# Altium project FunKello.PrjPcb
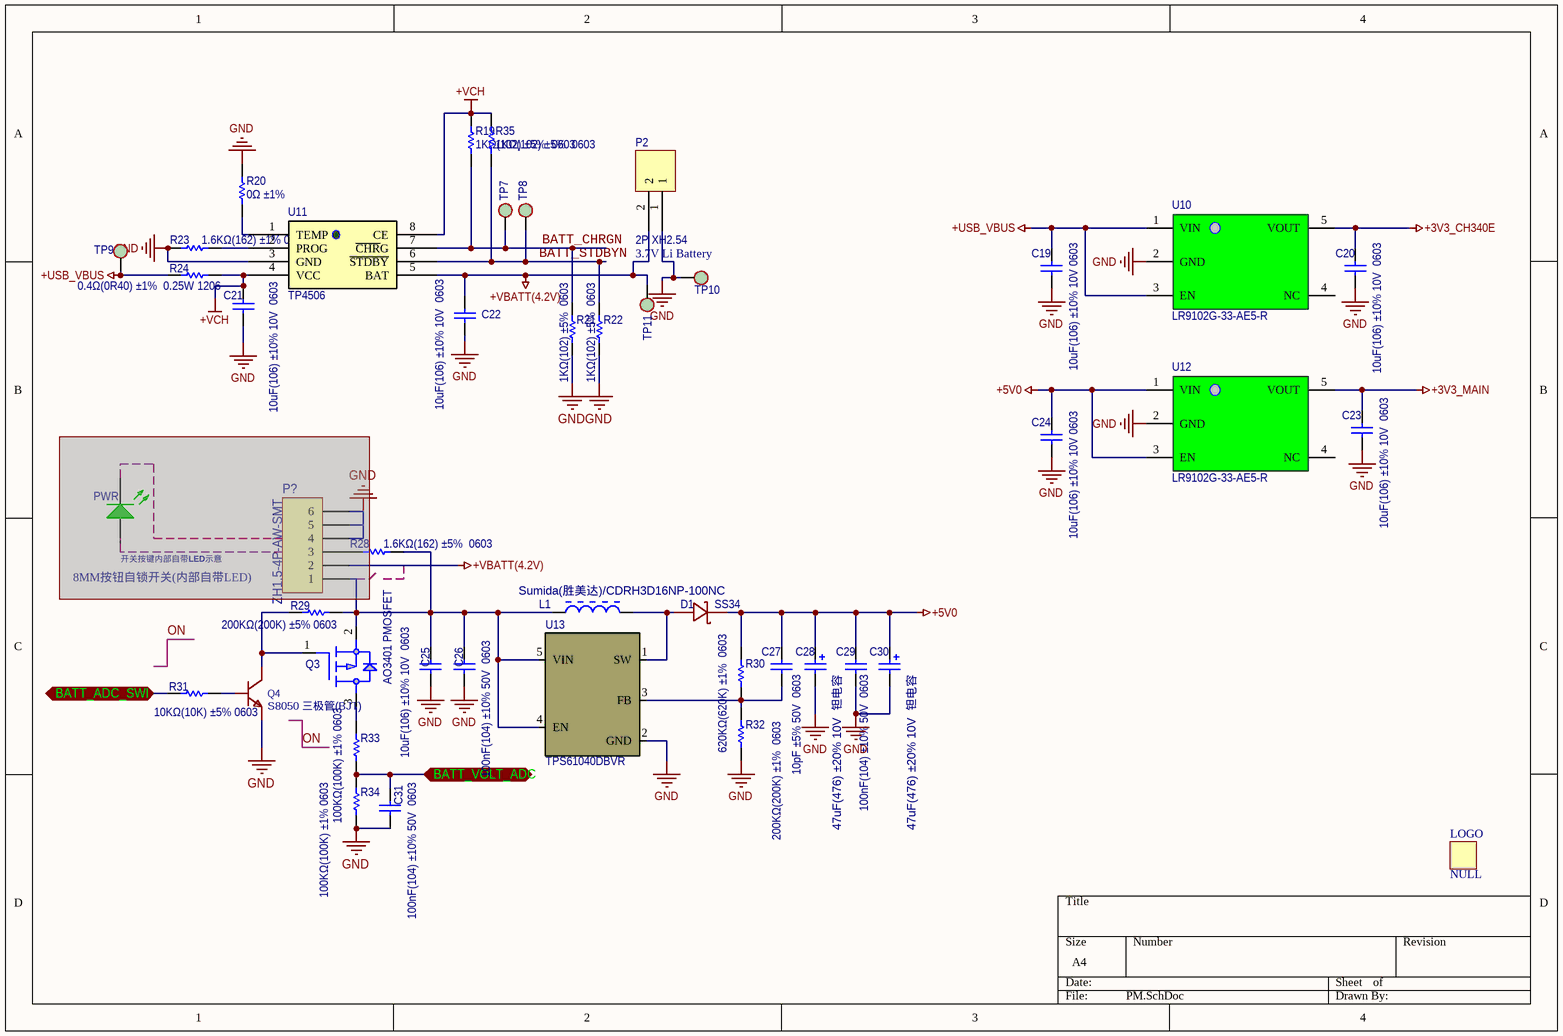
[diagram p0: PM.SchDoc]
8 sheets, 111 parts. Net scope: flat (ports and power ports of the same name join across sheets).
Board file: FunKello.PcbDoc
Sheets:
  PM.SchDoc
  USB.SchDoc
  SD.SchDoc
  MCU.SchDoc
  BEEP.SchDoc
  KEY.SchDoc
  LED.SchDoc
  SENSOR.SchDoc

## Sheet PM.SchDoc
size A4

### Parts
C19  10uF(106) ±10% 10V 0603  [C0603]
C20  10uF(106) ±10% 10V  0603  [C0603]
C21  10uF(106) ±10% 10V  0603  [C0603]
C22  10uF(106) ±10% 10V  0603  [C0603]
C23  10uF(106) ±10% 10V  0603  [C0603]
C24  10uF(106) ±10% 10V 0603  [C0603]
C25  10uF(106) ±10% 10V  0603  [C0603]
C26  100nF(104) ±10% 50V  0603  [C0603]
C27  10pF ±5% 50V  0603  [C0603]
C28  47uF(476) ±20% 10V  钽电容  [CASE-B_3528]
C29  100nF(104) ±10% 50V  0603  [C0603]
C30  47uF(476) ±20% 10V  钽电容  [CASE-B_3528]
C31  100nF(104) ±10% 50V  0603  [C0603]
D1  SS34  [SMA]
L1  Sumida(胜美达)/CDRH3D16NP-100NC  [L_3.8x3.8x1.8mm]
LED?  注释: PWR  [Through Hole-LED1]  (hidden comment: 翠绿LED, 贴片  发光二极管  0805)  (masked out: inside a compile mask, not in the netlist)
LOGO  NULL  [MYLOGO_BOTTOM]
P2  2P XH2.54  注释: 3.7V Li Battery  [MX1.25-2P]
P?  ZH1.5-4P-AW-SMT  注释: 8MM按钮自锁开关(内部自带LED)  [ZH1.5-6(4P)卧式-SMT]  (masked out: inside a compile mask, not in the netlist)
Q3  AO3401 PMOSFET  [SOT233]
Q4  S8050 三极管(BJT)  [SOT233]
R19  1KΩ(102) ±5%  0603  [R0603]
R20  0Ω ±1%  [R0603]
R21  1KΩ(102) ±5%  0603  [R0603]
R22  1KΩ(102) ±5%  0603  [R0603]
R23  1.6KΩ(162) ±1% 0603  [R0603]
R24  0.4Ω(0R40) ±1%  0.25W 1206  [R1206]
R28  1.6KΩ(162) ±5%  0603  [R0603]
R29  200KΩ(200K) ±5% 0603  [R0603]
R30  620KΩ(620K) ±1%  0603  [R0603]
R31  10KΩ(10K) ±5% 0603  [R0603]
R32  200KΩ(200K) ±1%  0603  [R0603]
R33  100KΩ(100K) ±1% 0603  [R0603]
R34  100KΩ(100K) ±1% 0603  [R0603]
R35  1KΩ(102) ±5%  0603  [R0603]
TP7  NC  [TP]  (value not drawn)
TP8  NC  [TP]  (value not drawn)
TP9  NC  [TP]  (value not drawn)
TP10  NC  [TP]  (value not drawn)
TP11  NC  [TP]  (value not drawn)
U10  LR9102G-33-AE5-R  [SOT-235]
U11  TP4506  [ESOP-8]
U12  LR9102G-33-AE5-R  [SOT-235]
U13  TPS61040DBVR  [SOT-235]

### Ports
BATT_ADC_SWI, BATT_VOLT_ADC

### Nets
+3V3_CH340E: C20.2 U10.5(VOUT)
+3V3_MAIN: C23.2 U12.5(VOUT)
+5V0: C24.2 C27.1 C28.1 C29.1 C30.1 D1.1(C) R30.1 U12.1(VIN) U12.3(EN)
+USB_VBUS: C19.2 R24.2 TP9.1 U10.1(VIN) U10.3(EN)
+VBATT(4.2V): C22.2 P2.2 TP11.1 U11.5(BAT)
+VCH: C21.2 R19.1 R24.1 R35.1 U11.4(VCC) U11.8(CE)
GND: C19.1 C20.1 C21.1 C22.1 C23.1 C24.1 C25.2 C26.2 C28.2 C29.2 C30.2 C31.1 P2.1 Q4.2(E) R20.1 R21.2 R22.2 R23.2 R32.2 R34.2 TP10.1 U10.2(GND) U11.3(GND) U12.2(GND) U13.2(GND)
BATT_CHRGN: R19.2 R21.1 TP7.1 U11.7(~{CHR}G)
BATT_STDBYN: R22.1 R35.2 TP8.1 U11.6(~{STDBY})
NetC25_1: C25.1 C26.1 L1.1 Q3.2(SOURCE) R28.1 R29.1 U13.4(EN) U13.5(VIN)
NetC27_2: C27.2 R30.2 R32.1 U13.3(FB)
NetC31_2: C31.2 R33.2 R34.1 ; port BATT_VOLT_ADC
NetD1_2: D1.2(A) L1.2 U13.1(SW)
NetQ3_1: Q3.1(GATE) Q4.3(C) R29.2
NetQ3_3: Q3.3(DRAIN) R33.1
NetQ4_1: Q4.1(B) R31.1
NetR20_2: R20.2 U11.1(TEMP)
NetR23_1: R23.1 U11.2(PROG)
NetR31_2: R31.2 ; port BATT_ADC_SWI

Not connected (* = marked no-connect by the designer): R28 2; U10 4(NC); U12 4(NC)

### Notes on the sheet
- (near LED?) 开关按键内部自带LED示意
- ON

### Library data of the parts
C19-C27 C29 C31 = Cap: 0603贴片电容; Published: 8-Jun-2000; LatestRevisionDate: 17-Jul-2002; LatestRevisionNote: Re-released for DXP Platform.; PackageReference: RAD-0.3; Publisher: Altium Limited; PackageDescription: Radial Cap, Thru-Hole; 2 Leads; 0.3 in Pin Spacing
C28 C30 = Cap Pol2: CASE_B 3528钽电容; Published: 8-Jun-2000; LatestRevisionDate: 17-Jul-2002; LatestRevisionNote: Re-released for DXP Platform.; PackageReference: POLAR0.8; Publisher: Altium Limited; PackageDescription: Polarized Capacitor; 2 Leads
D1 = PMEG3005EB,115: Shottky 二极管; BOM_Manufacturer: Nexperia; Contributor: LCSC; BOM_Supplier: LCSC; BOM_Supplier Part: C455040; BOM_Manufacturer Part: PMEG3005EB,115; spicePre: D; spiceSymbolName: PMEG3005EB,115
L1 = CMP-0686-00187-3: Chip Ferrite Bead for General Use, 600 Ohm, 300 mA, -55 to 125 degC, 1 x 0.5 x 0.55 mm SMD, Tape and Reel; Manufacturer: Murata; PartNumber: BLM15AG601SN1D; Impedance (at 100 MHz): 600 Ohm +/- 25%; DC Resistance: 0.52 Ohm Max.; Rated Current: 300 mA; PackageDescription: 2-Pin Chip, Body 1 x 0.5 mm; Mounting Technology: Surface Mount; ComponentLink1Description: Manufacturer URL; ComponentLink3Description: Package Specification; ComponentLink2Description: Datasheet; Operating Temperature Range: -55 to 125 degC; Packing: Tape and Reel; ComponentLink1URL: http://www.murata.com/; PackageReference: BLM15-2; DatasheetVersion: 08/2013; ComponentLink3URL: http://www.murata.com/products/catalog/pdf/c31e.pdf; ComponentLink2URL: http://www.murata.com/products/catalog/pdf/c31e.pdf; Value: Sumida(胜美达)/CDRH3D16NP-100NC
LED? = LTST-C190KGKT: LED GREEN CLEAR 0603 SMD; Manufacturer: Lite-On Inc.; Manufacturer part #: LTST-C190KGKT; Creation date: 04-Jul-2017; Created by: eteofilo; Modified by: *; Indications: *; Value: *
LOGO = MYLOGO_BOTTOM: LOGO
P2 = Header 2x1 0.05'' PTH: XH2.54-2P座子; Manufacturer: Sullins Connector Solutions; Manufacturer Part #: GRPB021VWVN-RC; Created By: Jose; Creation Date: 7-Sept-2017; Modified by: *; Indications: *
P? = Header 6: Header, 6-Pin; LatestRevisionDate: 17-Jul-2002; LatestRevisionNote: Re-released for DXP Platform.; Publisher: Altium Limited
Q3 = MOSFET_P_0: P沟道 MOSFET
Q4 = S8050_C908252: NPN 三极管(BJT); BOM_Manufacturer: FUXINSEMI; Contributor: LCSC; BOM_Supplier: LCSC; BOM_Supplier Part: C908252; BOM_Manufacturer Part: S8050; BOM_JLCPCB Part Class: Extended Part; spicePre: Q; spiceSymbolName: S8050_C908252
R19-R23 R28-R35 = Res1: 0603贴片电阻; Published: 8-Jun-2000; LatestRevisionDate: 17-Jul-2002; LatestRevisionNote: Re-released for DXP Platform.; PackageReference: AXIAL-0.3; Publisher: Altium Limited; PackageDescription: Axial Device, Thru-Hole; 2 Leads; 0.3 in Pin Spacing
R24 = Res1: 1206贴片电阻; Published: 8-Jun-2000; LatestRevisionDate: 17-Jul-2002; LatestRevisionNote: Re-released for DXP Platform.; PackageReference: AXIAL-0.3; Publisher: Altium Limited; PackageDescription: Axial Device, Thru-Hole; 2 Leads; 0.3 in Pin Spacing
TP7-TP11 = TP: 测试点
U10 U12 = LR9102G-33-AE5-R: 线性稳压器(LDO)
U11 = TP4056: 锂电池充电管理IC
U13 = TPS61040 /Boost: DCDC电源IC

## Sheet USB.SchDoc
size A4
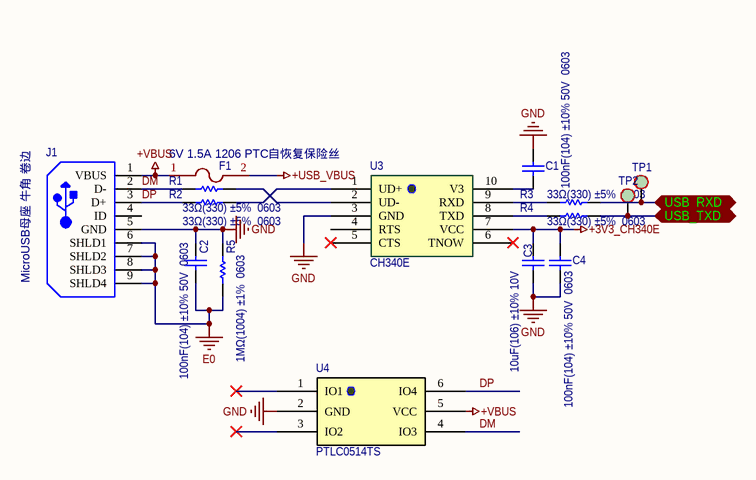
[diagram p1: USB.SchDoc]

### Parts
C1  100nF(104) ±10% 50V  0603  [C0603]
C2  100nF(104) ±10% 50V  0603  [C0603]
C3  10uF(106) ±10% 10V  [C0603]
C4  100nF(104) ±10% 50V  0603  [C0603]
F1  6V 1.5A 1206 PTC自恢复保险丝  [F1206]
J1  MicroUSB母座 牛角 卷边  [MICRO USB 母座 小牛角有柱 卷边]
R1  33Ω(330) ±5%  0603  [R0603]
R2  33Ω(330) ±5%  0603  [R0603]
R3  33Ω(330) ±5%  0603  [R0603]
R4  33Ω(330) ±5%  0603  [R0603]
R5  1MΩ(1004) ±1%  0603  [R0603]
TP1  NC  [TP]  (value not drawn)
TP2  NC  [TP]  (value not drawn)
U3  CH340E  [MSOP-10]
U4  PTLC0514TS  [SOT-236]

### Ports
USB_RXD, USB_TXD

### Nets
+3V3_CH340E: C3.2 C4.1 U3.7(VCC)
+USB_VBUS: F1.2
+VBUS: F1.1 J1.1(VBUS) U4.5(VCC)
E0: C2.1 J1.6(SHLD1) J1.7(SHLD2) J1.8(SHLD3) J1.9(SHLD4) R5.1
GND: C1.1 C2.2 C3.1 C4.2 J1.5(GND) R5.2 U3.3(GND) U4.2(GND)
DM: J1.2(D-) R1.2 U4.4(IO3)
DP: J1.3(D+) R2.2 U4.6(IO4)
NetC1_2: C1.2 U3.10(V3)
NetR1_1: R1.1 U3.2(UD-)
NetR2_1: R2.1 U3.1(UD+)
NetR3_1: R3.1 TP1.1 ; port USB_RXD
NetR3_2: R3.2 U3.9(RXD)
NetR4_1: R4.1 TP2.1 ; port USB_TXD
NetR4_2: R4.2 U3.8(TXD)

Not connected (* = marked no-connect by the designer): J1 4(ID); U3 4(RTS) 5(CTS)* 6(TNOW)*; U4 1(IO1)* 3(IO2)*

### Library data of the parts
C1-C4 = Cap: 0603贴片电容; Published: 8-Jun-2000; LatestRevisionDate: 17-Jul-2002; LatestRevisionNote: Re-released for DXP Platform.; PackageReference: RAD-0.3; Publisher: Altium Limited; PackageDescription: Radial Cap, Thru-Hole; 2 Leads; 0.3 in Pin Spacing
F1 = ASMD1206-150: 1206 PTC自恢复保险丝; BOM_Manufacturer: JDTFUSE; Contributor: LCSC; BOM_Paste Type: expand; BOM_Assembly Type: smtWeld; BOM_Supplier: LCSC; BOM_Manufacturer Part: ASMD1206-150; BOM_Supplier Part: C135341; spicePre: F; spiceSymbolName: ASMD1206-150
J1 = CMP-0029-00002-1: MicroUSB母座; Capacitance: 1 uF; Tolerance: 10%; ESR: 7.5 Ohm; Voltage Rating: 35 V; PackageDescription: USB Connector, 5 Position Surface Mount, Length 8 mm, Height 2.65 mm; DatasheetVersion: Aug-16; REACH SVHC: No SVHC; Package Quantity: 2000; ComponentLink1Description: Manufacturer URL; ComponentLink2URL: https://www.hirose.com/product/en/download_file/key_name/ZX62D-B-5P8/category/Catalog/doc_file_id/31704/?file_category_id=5&item_id=02420034000&is_series=; Length: 3.2 mm; ComponentLink1URL: https://www.hirose.com; Radiation Hardening: No; Height: 1.8 mm; Max Operating Temperature: 125degC; Weight: 0.000571 oz; Min Operating Temperature: -55degC; ComponentLink3Description: Package Specification; Width: 1.6 mm; Case Code (Metric): 3216; Mount: Surface Mount; ComponentLink2Description: Datasheet; Case Code (Imperial): 1206; ComponentLink3URL: https://www.hirose.com/product/en/download_file/key_name/ZX62D-B-5P8/category/Drawing%20(2D)/doc_file_id/36535/?file_category_id=6&item_id=02420034000&is_series=; Pins: 2; Resistance: 7.5 Ohm; Packaging: Tape and Reel; RoHSCompliant: True; Voltage Rating (DC): 35 V; Case/Package: 1206; PackageReference: ZX62D-B-5P8
R1-R5 = Res1: 0603贴片电阻; Published: 8-Jun-2000; LatestRevisionDate: 17-Jul-2002; LatestRevisionNote: Re-released for DXP Platform.; PackageReference: AXIAL-0.3; Publisher: Altium Limited; PackageDescription: Axial Device, Thru-Hole; 2 Leads; 0.3 in Pin Spacing
TP1 TP2 = TP: 测试点
U3 = CH340E: USB转串口IC

## Sheet SD.SchDoc
size A4
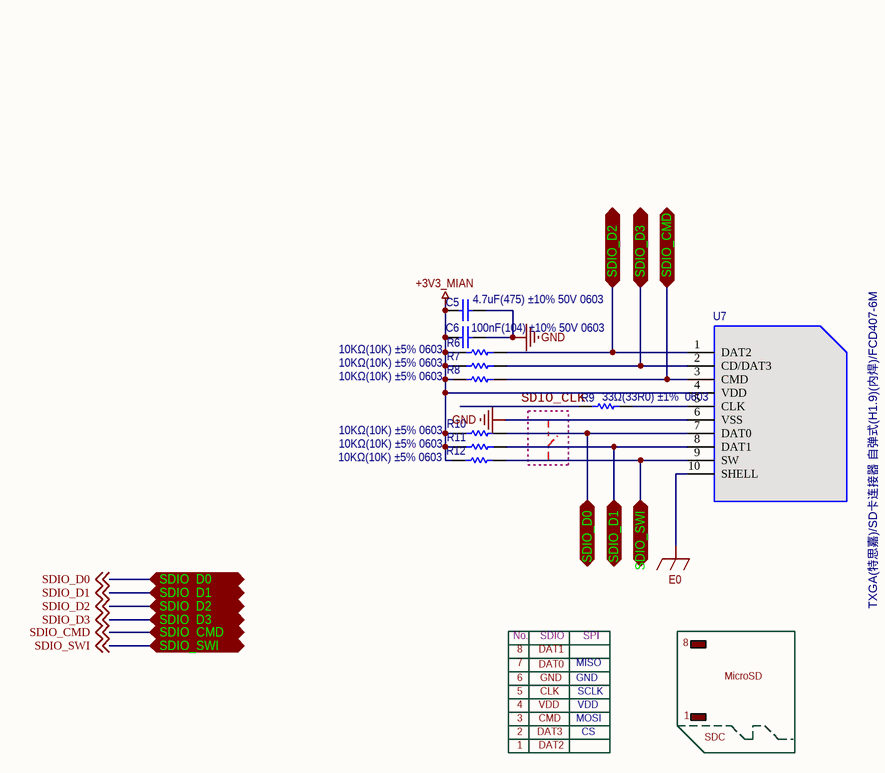
[diagram p2: SD.SchDoc]

### Parts
C5  4.7uF(475) ±10% 50V 0603  [C0603]
C6  100nF(104) ±10% 50V 0603  [C0603]
R6  10KΩ(10K) ±5% 0603  [R0603]
R7  10KΩ(10K) ±5% 0603  [R0603]
R8  10KΩ(10K) ±5% 0603  [R0603]
R9  33Ω(33R0) ±1%  0603  [R0603]
R10  10KΩ(10K) ±5% 0603  [R0603]
R11  10KΩ(10K) ±5% 0603  [R0603]
R12  10KΩ(10K) ±5% 0603  [R0603]
U7  TXGA(特思嘉)/SD卡连接器 自弹式(H1.9)(内焊)/FCD407-6M  [Micro SD]

### Ports
SDIO_CMD, SDIO_D0, SDIO_D1, SDIO_D2, SDIO_D3, SDIO_SWI

### Nets
+3V3_MIAN: C5.1 C6.2 R6.2 R7.2 R8.2 R10.2 R11.2 R12.2 U7.4(VDD)
E0: U7.10(SHELL)
GND: C5.2 C6.1 U7.6(VSS)
SDIO_CLK: R9.2
SDIO_CMD: R8.1 U7.3(CMD) ; off-sheet SDIO_CMD, port SDIO_CMD
SDIO_D0: R10.1 U7.7(DAT0) ; off-sheet SDIO_D0, port SDIO_D0
SDIO_D1: R11.1 U7.8(DAT1) ; off-sheet SDIO_D1, port SDIO_D1
SDIO_D2: R6.1 U7.1(DAT2) ; off-sheet SDIO_D2, port SDIO_D2
SDIO_D3: R7.1 U7.2(CD/DAT3) ; off-sheet SDIO_D3, port SDIO_D3
SDIO_SWI: R12.1 U7.9(SW) ; off-sheet SDIO_SWI, port SDIO_SWI
NetR9_1: R9.1 U7.5(CLK)

### Notes on the sheet
- No.
- 8
- 7
- DAT1
- DAT0
- SDIO
- MISO
- SPI
- 6
- 5
- 4
- 3
- 2
- DAT3
- VDD
- CMD
- GND
- CLK
- MOSI
- SCLK
- CS
- 1
- MicroSD
- DAT2
- SDC

### Library data of the parts
C5 C6 = Cap: Capacitor; Published: 8-Jun-2000; LatestRevisionDate: 17-Jul-2002; LatestRevisionNote: Re-released for DXP Platform.; PackageReference: RAD-0.3; Publisher: Altium Limited; PackageDescription: Radial Cap, Thru-Hole; 2 Leads; 0.3 in Pin Spacing
R6-R12 = Res1: Resistor; Published: 8-Jun-2000; LatestRevisionDate: 17-Jul-2002; LatestRevisionNote: Re-released for DXP Platform.; PackageReference: AXIAL-0.3; Publisher: Altium Limited; PackageDescription: Axial Device, Thru-Hole; 2 Leads; 0.3 in Pin Spacing
U7 = SD CARD/FCD407-6M

## Sheet MCU.SchDoc
size A4
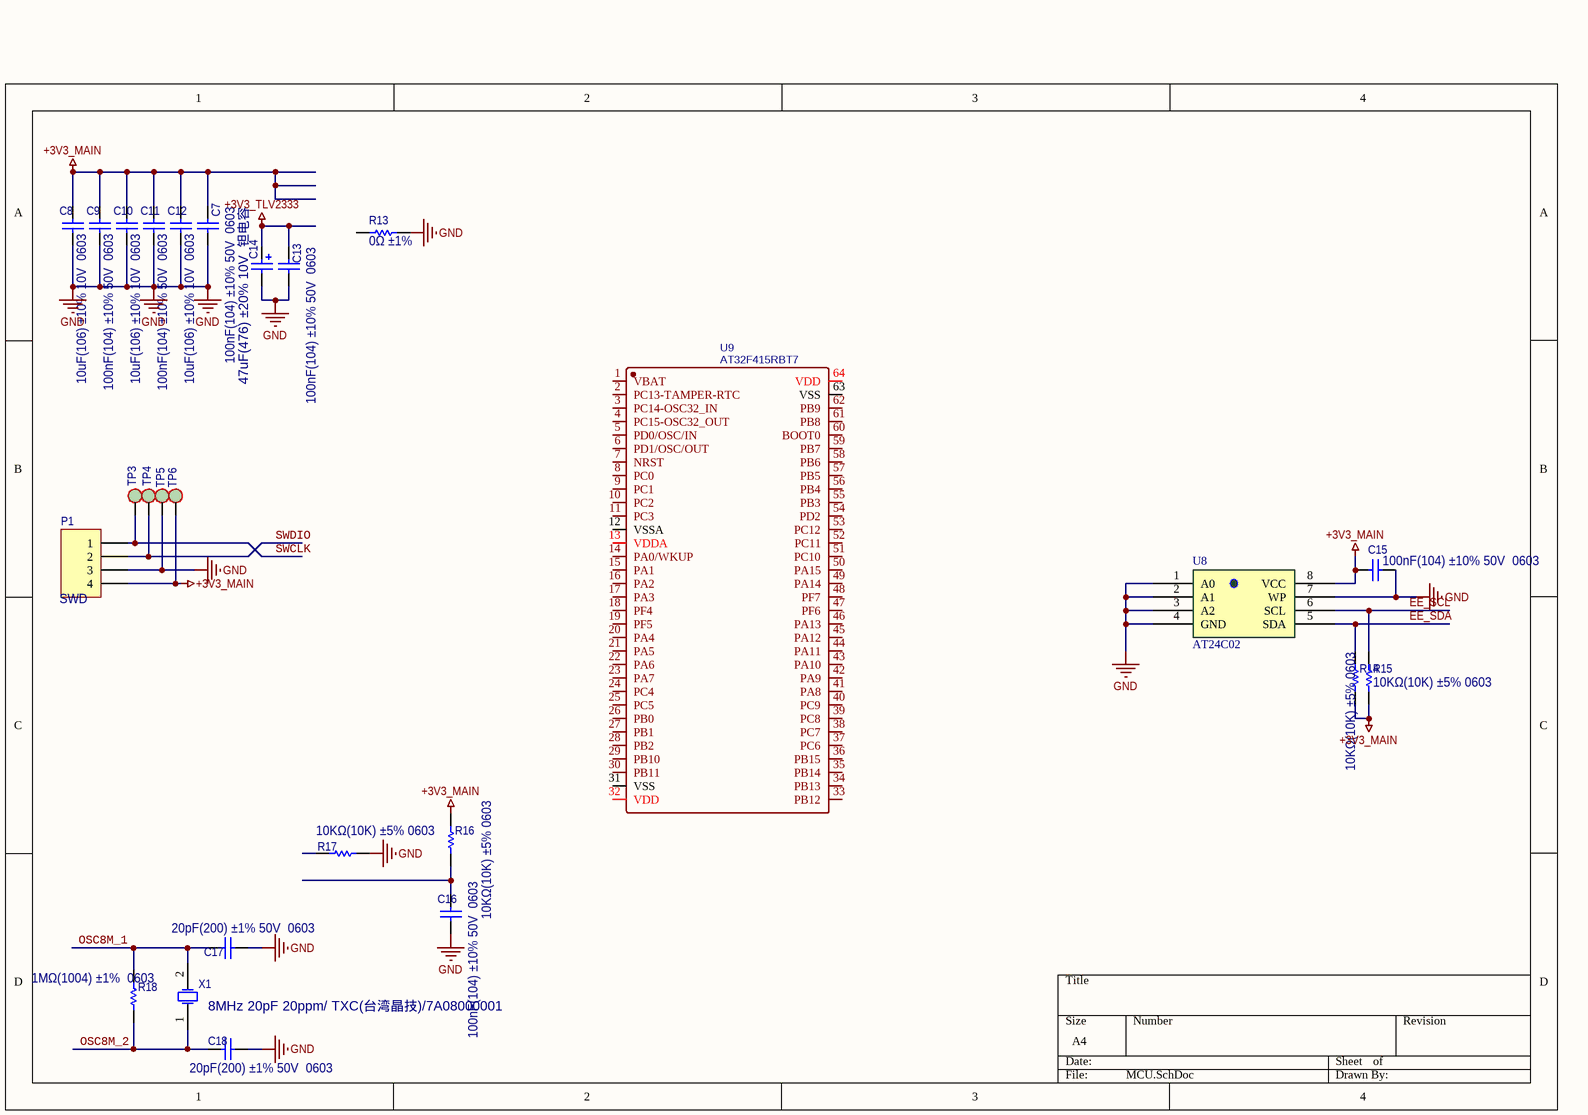
[diagram p3: MCU.SchDoc]

### Parts
C7  100nF(104) ±10% 50V  0603  [C0603]
C8  10uF(106) ±10% 10V  0603  [C0603]
C9  100nF(104) ±10% 50V  0603  [C0603]
C10  10uF(106) ±10% 10V  0603  [C0603]
C11  100nF(104) ±10% 50V  0603  [C0603]
C12  10uF(106) ±10% 10V  0603  [C0603]
C13  100nF(104) ±10% 50V  0603  [C0603]
C14  47uF(476) ±20% 10V  钽电容  [CASE-B_3528]
C15  100nF(104) ±10% 50V  0603  [C0603]
C16  100nF(104) ±10% 50V  0603  [C0603]
C17  20pF(200) ±1% 50V  0603  [C0603]
C18  20pF(200) ±1% 50V  0603  [C0603]
P1  SWD  [HDR1X4]
R13  0Ω ±1%  [R0603]
R14  10KΩ(10K) ±5% 0603  [R0603]
R15  10KΩ(10K) ±5% 0603  [R0603]
R16  10KΩ(10K) ±5% 0603  [R0603]
R17  10KΩ(10K) ±5% 0603  [R0603]
R18  1MΩ(1004) ±1%  0603  [R0603]
TP3  NC  [TP]  (value not drawn)
TP4  NC  [TP]  (value not drawn)
TP5  NC  [TP]  (value not drawn)
TP6  NC  [TP]  (value not drawn)
U8  AT24C02  [SOIC-8_150mil]
U9  AT32F415RBT7  [LQFP64]
X1  8MHz 20pF 20ppm/ TXC(台湾晶技)/7A08000001  [CRY5032_2P_SMT]

### Nets
+3V3_MAIN: C7.2 C8.2 C9.2 C10.2 C11.2 C12.2 C15.2 P1.4 R14.2 R15.2 R16.1 TP6.1 U8.8(VCC)
+3V3_TLV2333: C13.2 C14.1
GND: C7.1 C8.1 C9.1 C10.1 C11.1 C12.1 C13.1 C14.2 C15.1 C16.1 C17.1 C18.1 P1.3 R13.1 R17.1 TP5.1 U8.1(A0) U8.2(A1) U8.3(A2) U8.4(GND) U8.7(WP)
EE_SCL: R15.1 U8.6(SCL)
EE_SDA: R14.1 U8.5(SDA)
OSC8M_1: C17.2 R18.1 X1.2
OSC8M_2: C18.2 R18.2 X1.1
SWCLK: P1.1 TP3.1
SWDIO: P1.2 TP4.1
NetC16_2: C16.2 R16.2

Not connected (* = marked no-connect by the designer): R13 2; R17 2; U9 1(VBAT) 2(PC13-TAMPER-RTC) 3(PC14-OSC32_IN) 4(PC15-OSC32_OUT) 5(PD0/OSC/IN) 6(PD1/OSC/OUT) 7(NRST) 8(PC0) 9(PC1) 10(PC2) 11(PC3) 12(VSSA) 13(VDDA) 14(PA0/WKUP) 15(PA1) 16(PA2) 17(PA3) 18(PF4) 19(PF5) 20(PA4) 21(PA5) 22(PA6) 23(PA7) 24(PC4) 25(PC5) 26(PB0) 27(PB1) 28(PB2) 29(PB10) 30(PB11) 31(VSS) 32(VDD) 33(PB12) 34(PB13) 35(PB14) 36(PB15) 37(PC6) 38(PC7) 39(PC8) 40(PC9) 41(PA8) 42(PA9) 43(PA10) 44(PA11) 45(PA12) 46(PA13) 47(PF6) 48(PF7) 49(PA14) 50(PA15) 51(PC10) 52(PC11) 53(PC12) 54(PD2) 55(PB3) 56(PB4) 57(PB5) 58(PB6) 59(PB7) 60(BOOT0) 61(PB8) 62(PB9) 63(VSS) 64(VDD)

### Library data of the parts
C7-C13 C15-C18 = Cap: 0603贴片电容; Published: 8-Jun-2000; LatestRevisionDate: 17-Jul-2002; LatestRevisionNote: Re-released for DXP Platform.; PackageReference: RAD-0.3; Publisher: Altium Limited; PackageDescription: Radial Cap, Thru-Hole; 2 Leads; 0.3 in Pin Spacing
C14 = Cap Pol2: CASE_B 3528钽电容; Published: 8-Jun-2000; LatestRevisionDate: 17-Jul-2002; LatestRevisionNote: Re-released for DXP Platform.; PackageReference: POLAR0.8; Publisher: Altium Limited; PackageDescription: Polarized Capacitor; 2 Leads
P1 = Header 4: 编程下载口; LatestRevisionDate: 17-Jul-2002; LatestRevisionNote: Re-released for DXP Platform.; Publisher: Altium Limited
R13-R18 = Res1: 0603贴片电阻; Published: 8-Jun-2000; LatestRevisionDate: 17-Jul-2002; LatestRevisionNote: Re-released for DXP Platform.; PackageReference: AXIAL-0.3; Publisher: Altium Limited; PackageDescription: Axial Device, Thru-Hole; 2 Leads; 0.3 in Pin Spacing
TP3-TP6 = TP: 测试点
U8 = 24CXX: 非易失性存储器(ROM)
U9 = AT32F415RBT7: BOM_Manufacturer: Artery; Contributor: LCSC; BOM_Supplier: LCSC; BOM_Supplier Part: C528433; BOM_Manufacturer Part: AT32F415RBT7; BOM_JLCPCB Part Class: Extended Part; spicePre: U; spiceSymbolName: AT32F415RBT7
X1 = XTAL_SMD: 无源晶振  SMD-5032_2P; ERP: 0103040021; TOL: ±20ppm; Tolerate: ROSON -20_+70 20pf; PCB_Layout: Top Layer SMC; Value: 8MHz; Publisher: ZL_A0OFFICE; Revision: 2012-3-28

## Sheet BEEP.SchDoc
size A4
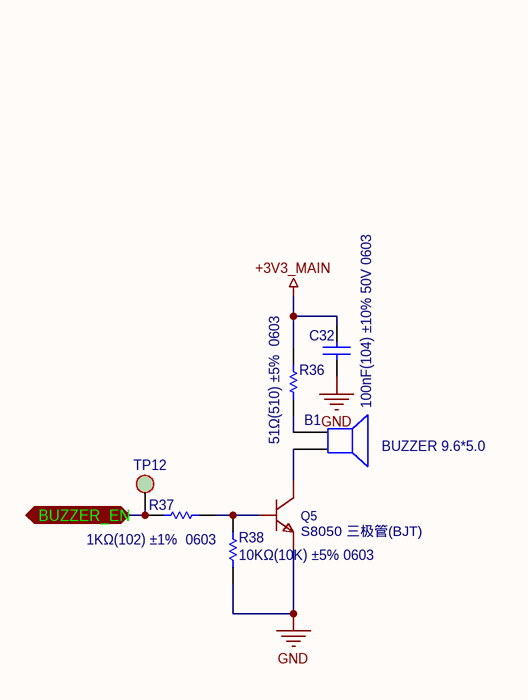
[diagram p4: BEEP.SchDoc]

### Parts
B1  BUZZER 9.6*5.0  [BUZZER 9.6×H5.0mm]
C32  100nF(104) ±10% 50V 0603  [C0603]
Q5  S8050 三极管(BJT)  [SOT233]
R36  51Ω(510) ±5%  0603  [R0603]
R37  1KΩ(102) ±1%  0603  [R0603]
R38  10KΩ(10K) ±5% 0603  [R0603]
TP12  NC  [TP]  (value not drawn)

### Ports
BUZZER_EN

### Nets
+3V3_MAIN: C32.1 R36.2
GND: C32.2 Q5.2(E) R38.2
NetB1_1: B1.1 R36.1
NetB1_2: B1.2 Q5.3(C)
NetQ5_1: Q5.1(B) R37.1 R38.1
NetR37_2: R37.2 TP12.1 ; port BUZZER_EN

### Library data of the parts
B1 = Speaker: 直插蜂鸣器 9.6*5.0; Published: 24-Mar-1999; LatestRevisionDate: 17-Jul-2002; LatestRevisionNote: Re-released for DXP Platform.; PackageReference: PIN2; Publisher: Altium Limited
C32 = Cap: 0603贴片电容; Published: 8-Jun-2000; LatestRevisionDate: 17-Jul-2002; LatestRevisionNote: Re-released for DXP Platform.; PackageReference: RAD-0.3; Publisher: Altium Limited; PackageDescription: Radial Cap, Thru-Hole; 2 Leads; 0.3 in Pin Spacing
Q5 = S8050_C908252: as Q4 on sheet PM; BOM_Supplier: LCSC; BOM_Supplier Part: C908252; BOM_Manufacturer Part: S8050; BOM_JLCPCB Part Class: Extended Part; spicePre: Q; spiceSymbolName: S8050_C908252
R36-R38 = Res1: 0603贴片电阻; Published: 8-Jun-2000; LatestRevisionDate: 17-Jul-2002; LatestRevisionNote: Re-released for DXP Platform.; PackageReference: AXIAL-0.3; Publisher: Altium Limited; PackageDescription: Axial Device, Thru-Hole; 2 Leads; 0.3 in Pin Spacing
TP12 = TP: 测试点

## Sheet KEY.SchDoc
size A4

## Sheet LED.SchDoc
size A4
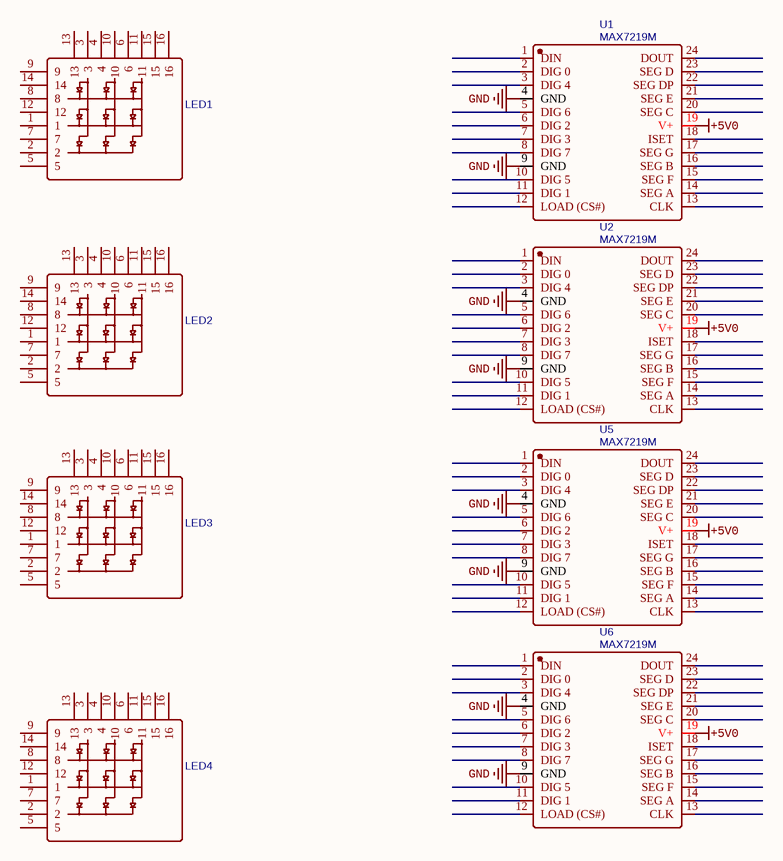
[diagram p5: LED.SchDoc]

### Parts
LED1  (no value)  [matrix_led]
LED2  (no value)  [matrix_led]
LED3  (no value)  [matrix_led]
LED4  (no value)  [matrix_led]
U1  MAX7219M  [SOP-24_300mil]
U2  MAX7219M  [SOP-24_300mil]
U5  MAX7219M  [SOP-24_300mil]
U6  MAX7219M  [SOP-24_300mil]

### Nets
+5V0: U1.19(V+) U2.19(V+) U5.19(V+) U6.19(V+)
GND: U1.4(GND) U1.9(GND) U2.4(GND) U2.9(GND) U5.4(GND) U5.9(GND) U6.4(GND) U6.9(GND)

Not connected (* = marked no-connect by the designer): LED1 1 2 3 4 5 6 7 8 9 10 11 12 13 14 15 16; LED2 1 2 3 4 5 6 7 8 9 10 11 12 13 14 15 16; LED3 1 2 3 4 5 6 7 8 9 10 11 12 13 14 15 16; LED4 1 2 3 4 5 6 7 8 9 10 11 12 13 14 15 16; U1 1(DIN) 2(DIG_0) 3(DIG_4) 5(DIG_6) 6(DIG_2) 7(DIG_3) 8(DIG_7) 10(DIG_5) 11(DIG_1) 12(LOAD_(CS#)) 13(CLK) 14(SEG_A) 15(SEG_F) 16(SEG_B) 17(SEG_G) 18(ISET) 20(SEG_C) 21(SEG_E) 22(SEG_DP) 23(SEG_D) 24(DOUT); U2 1(DIN) 2(DIG_0) 3(DIG_4) 5(DIG_6) 6(DIG_2) 7(DIG_3) 8(DIG_7) 10(DIG_5) 11(DIG_1) 12(LOAD_(CS#)) 13(CLK) 14(SEG_A) 15(SEG_F) 16(SEG_B) 17(SEG_G) 18(ISET) 20(SEG_C) 21(SEG_E) 22(SEG_DP) 23(SEG_D) 24(DOUT); U5 1(DIN) 2(DIG_0) 3(DIG_4) 5(DIG_6) 6(DIG_2) 7(DIG_3) 8(DIG_7) 10(DIG_5) 11(DIG_1) 12(LOAD_(CS#)) 13(CLK) 14(SEG_A) 15(SEG_F) 16(SEG_B) 17(SEG_G) 18(ISET) 20(SEG_C) 21(SEG_E) 22(SEG_DP) 23(SEG_D) 24(DOUT); U6 1(DIN) 2(DIG_0) 3(DIG_4) 5(DIG_6) 6(DIG_2) 7(DIG_3) 8(DIG_7) 10(DIG_5) 11(DIG_1) 12(LOAD_(CS#)) 13(CLK) 14(SEG_A) 15(SEG_F) 16(SEG_B) 17(SEG_G) 18(ISET) 20(SEG_C) 21(SEG_E) 22(SEG_DP) 23(SEG_D) 24(DOUT)

### Library data of the parts
LED1-LED4 = SLD0888DWC1BY: BOM_Manufacturer: SUNLIGHT; Contributor: LCSC; BOM_Supplier: LCSC; BOM_Supplier Part: C225986; BOM_Manufacturer Part: SLD0888DWC1BY; BOM_JLCPCB Part Class: Extended Part; spicePre: L; spiceSymbolName: SLD0888DWC1BY
U1 U2 U5 U6 = MAX7219M: BOM_Manufacturer: HGSEMI(华冠); Contributor: LCSC; BOM_Supplier: LCSC; BOM_Supplier Part: C492110; BOM_Manufacturer Part: MAX7219M; BOM_JLCPCB Part Class: Extended Part; spicePre: U; spiceSymbolName: MAX7219M

## Sheet SENSOR.SchDoc
size A4
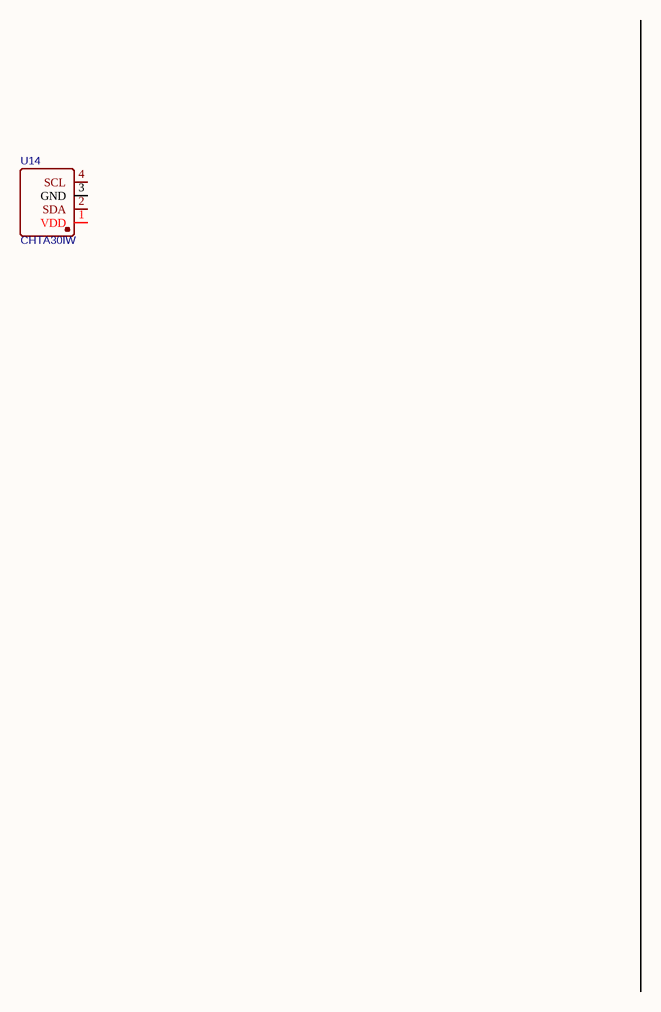
[diagram p6: SENSOR.SchDoc]

### Parts
U14  CHTA30IW  [SENSOR-TH_CHTA30IW]

### Nets

Not connected (* = marked no-connect by the designer): U14 1(VDD) 2(SDA) 3(GND) 4(SCL)

### Library data of the parts
U14 = CHTA30IW: BOM_Manufacturer: CYBERSEN; Contributor: LCSC; BOM_Supplier: LCSC; BOM_Supplier Part: C393714; BOM_Manufacturer Part: CHTA30IW; BOM_JLCPCB Part Class: Extended Part; spicePre: U; spiceSymbolName: CHTA30IW

## Nets that join several sheets
+3V3_CH340E: PM (C20.2 U10.5), USB (C3.2 C4.1 U3.7)
+3V3_MAIN: PM (C23.2 U12.5), MCU (13 pins), BEEP (C32.1 R36.2)
+5V0: PM (9 pins), LED (U1.19 U2.19 U5.19 U6.19)
+USB_VBUS: PM (5 pins), USB (F1.2)
E0: USB (6 pins), SD (U7.10)
GND: PM (25 pins), USB (8 pins), SD (C5.2 C6.1 U7.6), MCU (21 pins), BEEP (C32.2 Q5.2 R38.2), LED (8 pins)